# Altium project telemetry_board.PrjPcb
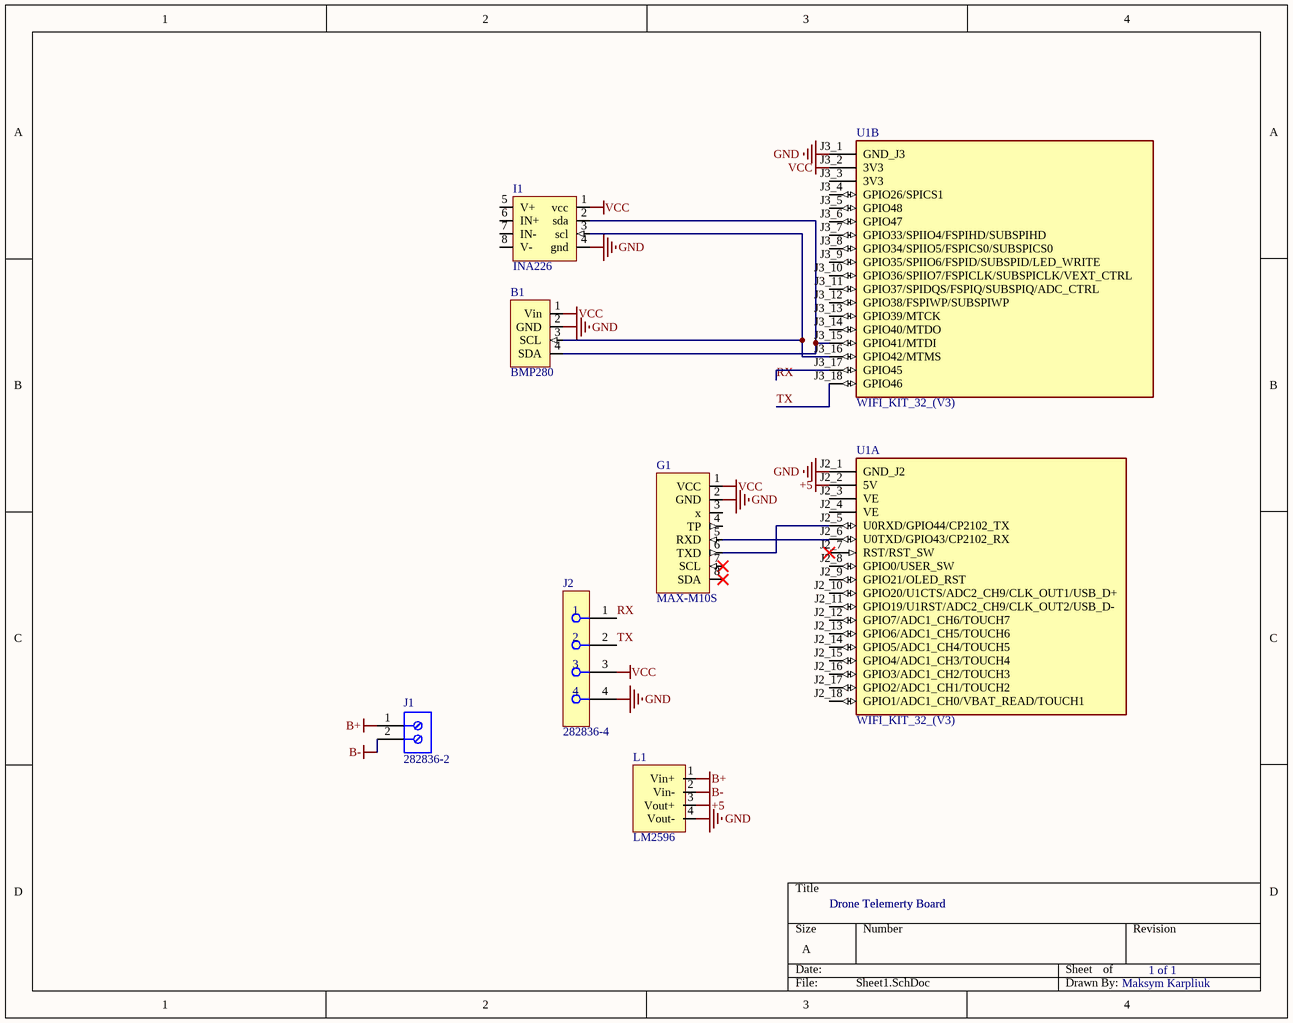
[diagram p0: Sheet1.SchDoc]
1 sheet, 7 parts. Net scope: global (net labels, ports and power ports of the same name join across sheets).
Board file: PCB1.PcbDoc

## Sheet Sheet1.SchDoc
size A; SheetNumber: 1; SheetTotal: 1

### Parts
B1  BMP280  [BMP280]
G1  MAX-M10S  [MAX-M10S]
I1  INA226  [INA226]
J1  282836-2  [TECO-282836-2_V]
J2  282836-4  [FP-282836-4-MFG]
L1  LM2596  [LM2596]
U1  WIFI_KIT_32_(V3)  [MODULE_WIFI_KIT_32_(V3)]  (parts A,B of 2)

### Nets
+5: L1.3(Vout+) U1.J2_2(5V)
B+: J1.1 L1.1(Vin+)
B-: J1.2 L1.2(Vin-)
GND: B1.2(GND) G1.2(GND) I1.4(gnd) J2.4 L1.4(Vout-) U1.J2_1(GND_J2) U1.J3_1(GND_J3)
VCC: B1.1(Vin) G1.1(VCC) I1.1(vcc) J2.3 U1.J3_2(3V3)
RX: J2.1 U1.J3_17(GPIO45)
TX: J2.2 U1.J3_18(GPIO46)
NetB1_3: B1.3(SCL) I1.3(scl) U1.J3_16(GPIO42/MTMS)
NetB1_4: B1.4(SDA) I1.2(sda) U1.J3_15(GPIO41/MTDI)
NetG1_5: G1.5(RXD) U1.J2_6(U0TXD/GPIO43/CP2102_RX)
NetG1_6: G1.6(TXD) U1.J2_5(U0RXD/GPIO44/CP2102_TX)

Not connected (* = marked no-connect by the designer): G1 3(x) 4(TP) 7(SCL)* 8(SDA)*; I1 5(V+) 6(IN+) 7(IN-) 8(V-); U1 J2_3(VE) J2_4(VE) J2_7(RST/RST_SW)* J2_8(GPIO0/USER_SW) J2_9(GPIO21/OLED_RST) J2_10(GPIO20/U1CTS/ADC2_CH9/CLK_OUT1/USB_D+) J2_11(GPIO19/U1RST/ADC2_CH9/CLK_OUT2/USB_D-) J2_12(GPIO7/ADC1_CH6/TOUCH7) J2_13(GPIO6/ADC1_CH5/TOUCH6) J2_14(GPIO5/ADC1_CH4/TOUCH5) J2_15(GPIO4/ADC1_CH3/TOUCH4) J2_16(GPIO3/ADC1_CH2/TOUCH3) J2_17(GPIO2/ADC1_CH1/TOUCH2) J2_18(GPIO1/ADC1_CH0/VBAT_READ/TOUCH1) J3_3(3V3) J3_4(GPIO26/SPICS1) J3_5(GPIO48) J3_6(GPIO47) J3_7(GPIO33/SPIIO4/FSPIHD/SUBSPIHD) J3_8(GPIO34/SPIIO5/FSPICS0/SUBSPICS0) J3_9(GPIO35/SPIIO6/FSPID/SUBSPID/LED_WRITE) J3_10(GPIO36/SPIIO7/FSPICLK/SUBSPICLK/VEXT_CTRL) J3_11(GPIO37/SPIDQS/FSPIQ/SUBSPIQ/ADC_CTRL) J3_12(GPIO38/FSPIWP/SUBSPIWP) J3_13(GPIO39/MTCK) J3_14(GPIO40/MTDO)

### Notes on the sheet
- Drone Telemerty Board
- 1 of 1
- Maksym Karpliuk

### Library data of the parts
J1 = CMP-1684-00017-1: Female Header, Pitch 5 mm, 1 x 2 Position, Height 10 mm, Tail Length 3.5 mm, Rohs, Bulk; Manufacturer: TE Connectivity; Wire Gauge: 16-30AWG; Product Training Modules: Wire-to-BoardEurostyleTerminalBlocks; Clamp Material - Plating: Brass-NickelPlated; Voltage: 300V; Mating Orientation: HorizontalwithBoard; Current: 13.5A; Pitch: 0.197"(5.00mm); Screw Thread: M3; 3D Model: 282836-2.pdf; Other Names: 5ULV-02B / A98076; Dynamic Catalog: BuchananSeries; Number of Levels: 1; Torque - Screw: 0.68Nm(6Lb-In); Featured Product: EurostyleTerminalBlockConnectors; Positions Per Level: 2; Wire Termination: Screw-RisingCageClamp; Datasheet URL: http://www.te.com.cn/commerce/DocumentDelivery/DDEController?Action=showdoc&DocId=Catalog+Section%7F1308389_EUROSTYLE_TERMINAL_BLOCKS%7F0607%7Fpdf%7FEnglish%7FENG_CS_1308389_EUROSTYLE_TERMINAL_BLOCKS_0607.pdf%7F282836-2; Color: Green; Family: TerminalBlocks-WiretoBoard; RoHS Information: 282836-2StatementofCompliance; Standard Package: 300; Contact Material - Plating: Brass-TinPlated; Manufacturer URL: http://www.te.com; Housing Material: Polyamide(PA66),Nylon6/6; Features: Interlocking(Side); Package Description: Female Header, Pitch 5 mm, 1 x 2 Position, Height 10 mm, Tail Length 3.5 mm; Mounting Type: ThroughHole; Package Reference: THD; Packaging: Bulk; Series: Buchanan; Category: Connectors,Interconnects; Screw Material - Plating: Brass-NickelPlated
J2 = CMP-03790-46505329-1: 282836-4 Connector, Terminal Block; Wire Receptacle; 4 Pos.; 16-30 AWG; 0.197 in. CL; Sid; Manufacturer Lifecycle Status: ACTIVE; Number of Contacts: 4; Max Supply Voltage (AC): 300V; Wire Gauge (Min): 30AWG; Max Current Rating: 13.5A; Approvals: UL; Number of Levels: 1; Thread Size: M3; Connector System: Wire-to-Board; Voltage Rating (DC): 250V; Pitch: 5mm; Plating: Brass; Tail Length: 3.5mm; Housing Color: Green; Number of Rows: 1; REACH SVHC: Unknown; Lead Pitch: 5mm; Depth: 8.2mm; Lead Free: Lead Free; Mount: Through Hole; Contact Plating: Tin; Housing Material: Polyamide; ELV: Compliant; Radiation Hardening: No; RoHS: Compliant; Number of Circuits: 4; Voltage Rating: 300V; Contact Material: Brass; NexarPartId: 46505329; Current Rating: 13.5A; Max Voltage Rating (AC): 300V; Orientation: Straight; Number of Positions: 4; Lifecycle Status: Production; Operating Supply Voltage: 300V; Connector Type: Receptacle; Number of Positions Per Level: 4; Flammability Rating: UL94 V-0; Packaging: Bulk; Termination: Screw, Solder; Wire Gauge (Max): 30AWG; Number of Poles: 4; Width: 10mm; Voltage Rating (AC): 250V; Length: 20mm; Current: 13.5A; Voltage: 300V; Color: Green
U1 = WIFI_KIT_32_(V3): *GPIO input only*ADC preamplifier*GPIOs are 3.3V tolerant only; MF: Heltec Automation; MP: WIFI KIT 32 (V3); SnapEDA_Link: https://www.snapeda.com/parts/WIFI%20KIT%2032%20(V3)/Heltec+Automation/view-part/?ref=snap; Package: Package; Value: *; Check_prices: https://www.snapeda.com/parts/WIFI%20KIT%2032%20(V3)/Heltec+Automation/view-part/?ref=eda